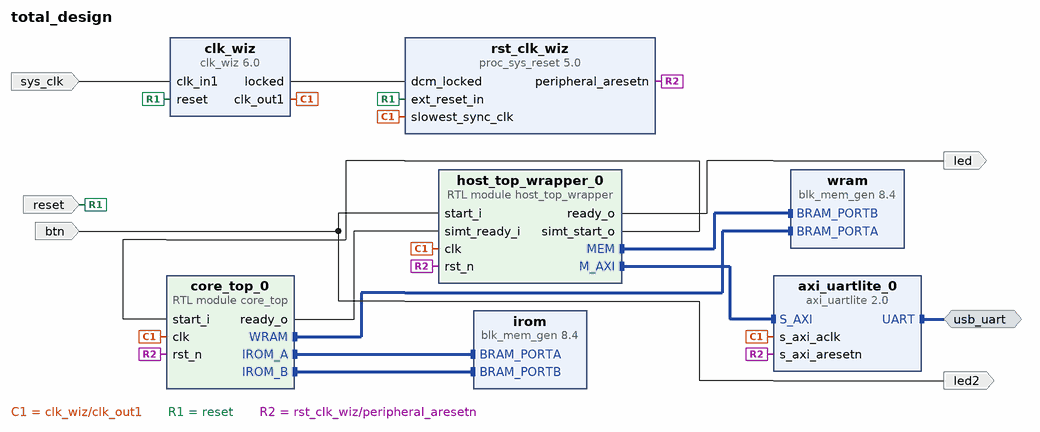
[diagram p0: block diagram of the top level]
# Vivado block design total_design, xc7a35tcpg236-1, Vivado 2025.2
create_bd_design total_design

create_bd_intf_port -mode Master -vlnv xilinx.com:interface:uart_rtl:1.0 usb_uart
create_bd_port -dir I -type clk sys_clk
set_property -dict {CONFIG.FREQ_HZ 12000000} [get_bd_ports sys_clk]
create_bd_port -dir I -type rst reset
set_property -dict {CONFIG.POLARITY ACTIVE_HIGH} [get_bd_ports reset]
create_bd_port -dir I btn
create_bd_port -dir O led
create_bd_port -dir O led2

create_bd_cell -type module -reference host_top_wrapper host_top_wrapper_0
set_property -dict {CONFIG.W_ADDR 13} [get_bd_cells host_top_wrapper_0]
create_bd_cell -type ip -vlnv xilinx.com:ip:axi_uartlite:2.0 axi_uartlite_0
create_bd_cell -type module -reference core_top core_top_0
set_property -dict {CONFIG.W_IROM_ADDR 13 CONFIG.W_WRAM_ADDR 15} [get_bd_cells core_top_0]
create_bd_cell -type ip -vlnv xilinx.com:ip:blk_mem_gen:8.4 irom
set_property -dict [list \
  CONFIG.Assume_Synchronous_Clk true \
  CONFIG.Coe_File ../../../../irom.coe \
  CONFIG.Enable_A Always_Enabled \
  CONFIG.Enable_B Always_Enabled \
  CONFIG.Load_Init_File true \
  CONFIG.Memory_Type Dual_Port_ROM \
  CONFIG.Register_PortA_Output_of_Memory_Primitives false \
  CONFIG.Register_PortB_Output_of_Memory_Primitives false \
  CONFIG.Write_Depth_A 2048 \
  CONFIG.use_bram_block Stand_Alone \
] [get_bd_cells irom]
create_bd_cell -type ip -vlnv xilinx.com:ip:blk_mem_gen:8.4 wram
set_property -dict [list \
  CONFIG.Assume_Synchronous_Clk true \
  CONFIG.Byte_Size 8 \
  CONFIG.Disable_Collision_Warnings false \
  CONFIG.Enable_A Always_Enabled \
  CONFIG.Enable_B Always_Enabled \
  CONFIG.Memory_Type True_Dual_Port_RAM \
  CONFIG.Register_PortA_Output_of_Memory_Primitives false \
  CONFIG.Register_PortB_Output_of_Memory_Primitives true \
  CONFIG.Use_Byte_Write_Enable true \
  CONFIG.Write_Depth_A 8192 \
  CONFIG.Write_Width_A 32 \
  CONFIG.use_bram_block Stand_Alone \
] [get_bd_cells wram]
create_bd_cell -type ip -vlnv xilinx.com:ip:clk_wiz:6.0 clk_wiz
set_property -dict [list \
  CONFIG.CLKIN1_JITTER_PS 833.33 \
  CONFIG.CLKOUT1_JITTER 522.315 \
  CONFIG.CLKOUT1_PHASE_ERROR 668.310 \
  CONFIG.CLKOUT1_REQUESTED_OUT_FREQ 50.0 \
  CONFIG.MMCM_CLKFBOUT_MULT_F 62.500 \
  CONFIG.MMCM_CLKIN1_PERIOD 83.333 \
  CONFIG.MMCM_CLKIN2_PERIOD 10.0 \
  CONFIG.MMCM_CLKOUT0_DIVIDE_F 15.000 \
  CONFIG.PRIM_IN_FREQ 12.000 \
] [get_bd_cells clk_wiz]
create_bd_cell -type ip -vlnv xilinx.com:ip:proc_sys_reset:5.0 rst_clk_wiz

# ---- connections ----

connect_bd_intf_net [get_bd_intf_ports usb_uart] [get_bd_intf_pins axi_uartlite_0/UART]
connect_bd_intf_net [get_bd_intf_pins core_top_0/IROM_A] [get_bd_intf_pins irom/BRAM_PORTA]
connect_bd_intf_net [get_bd_intf_pins core_top_0/IROM_B] [get_bd_intf_pins irom/BRAM_PORTB]
connect_bd_intf_net [get_bd_intf_pins core_top_0/WRAM] [get_bd_intf_pins wram/BRAM_PORTA]
connect_bd_intf_net [get_bd_intf_pins host_top_wrapper_0/MEM] [get_bd_intf_pins wram/BRAM_PORTB]
connect_bd_intf_net [get_bd_intf_pins host_top_wrapper_0/M_AXI] [get_bd_intf_pins axi_uartlite_0/S_AXI]
connect_bd_net [get_bd_ports btn] [get_bd_ports led2] [get_bd_pins host_top_wrapper_0/start_i]
connect_bd_net -net clk_100MHz_1 [get_bd_ports sys_clk] [get_bd_pins clk_wiz/clk_in1]
connect_bd_net [get_bd_pins clk_wiz/clk_out1] \
  [get_bd_pins axi_uartlite_0/s_axi_aclk] [get_bd_pins rst_clk_wiz/slowest_sync_clk] [get_bd_pins core_top_0/clk] \
  [get_bd_pins host_top_wrapper_0/clk]
connect_bd_net [get_bd_pins clk_wiz/locked] [get_bd_pins rst_clk_wiz/dcm_locked]
connect_bd_net [get_bd_pins core_top_0/ready_o] [get_bd_pins host_top_wrapper_0/simt_ready_i]
connect_bd_net [get_bd_pins host_top_wrapper_0/ready_o] [get_bd_ports led]
connect_bd_net [get_bd_pins host_top_wrapper_0/simt_start_o] [get_bd_pins core_top_0/start_i]
connect_bd_net -net reset_rtl_0_1 [get_bd_ports reset] [get_bd_pins clk_wiz/reset] [get_bd_pins rst_clk_wiz/ext_reset_in]
connect_bd_net -net rst_clk_wiz_100M_peripheral_aresetn [get_bd_pins rst_clk_wiz/peripheral_aresetn] \
  [get_bd_pins axi_uartlite_0/s_axi_aresetn] [get_bd_pins core_top_0/rst_n] [get_bd_pins host_top_wrapper_0/rst_n]

# ---- address map ----
assign_bd_address -offset 0x000 -range 128 -target_address_space [get_bd_addr_spaces host_top_wrapper_0/M_AXI] [get_bd_addr_segs axi_uartlite_0/S_AXI/Reg]

validate_bd_design
save_bd_design
